# EAGLE design programmer8.0 (EAGLE 6.3)
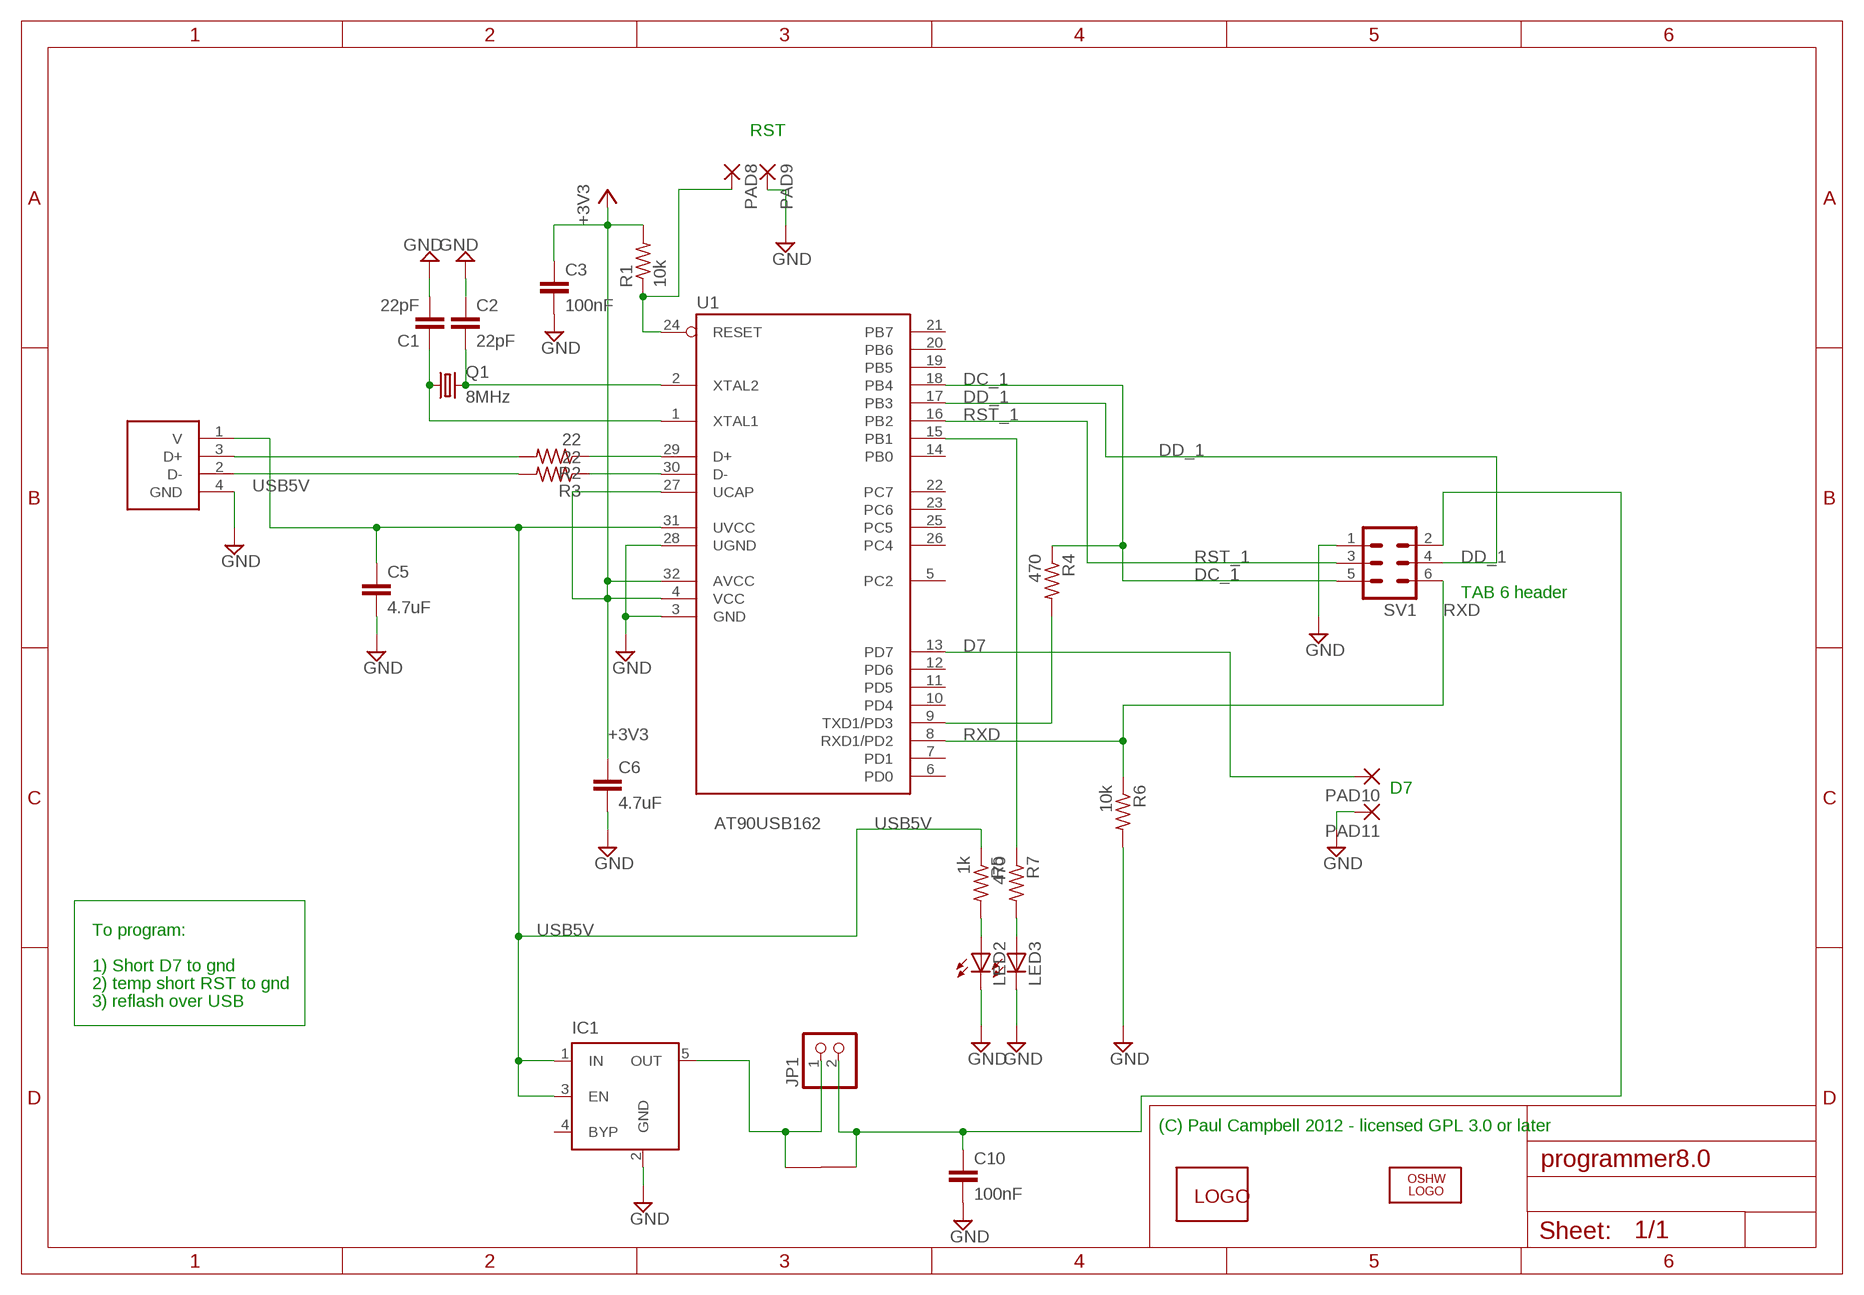
[diagram p0: schematic, sheet 1]

## Parts
C1  22pF  C-EUC0603  [C0603]
C2  22pF  C-EUC0603  [C0603]
C3  100nF  C-EUC0603  [C0603]
C5  4.7uF  C-EUC0805  [C0805]
C6  4.7uF  C-EUC0805  [C0805]
C10  100nF  C-EUC0603  [C0603]
IC1  MIC5219XX  [SOT23-5]
JP1  PINHD-1X2  [1X02]
LED2  LEDCHIP-LED0805  [CHIP-LED0805]
LED3  LEDCHIP-LED0805  [CHIP-LED0805]
LOGO2  OSHW_LOGO_FILLX0100-NT  [OSHW_FILLX100_NOTEXT]
PAD8  1,6/0,8  [1,6/0,8]
PAD9  1,6/0,8  [1,6/0,8]
PAD10  1,6/0,8  [1,6/0,8]
PAD11  1,6/0,8  [1,6/0,8]
Q1  8MHz  CRYSTALHC49UP  [HC49UP]
R1  10k  R-US_R0603  [R0603]
R2  22  R-US_R0603  [R0603]
R3  22  R-US_R0603  [R0603]
R4  470  R-US_R0603  [R0603]
R5  1k  R-US_R0603  [R0603]
R6  10k  R-US_R0603  [R0603]
R7  470  R-US_R0603  [R0603]
SV1  MA03-2  [MA03-2]
U1  AT90USB162  [TQFP32-08]
U$1  LINK  [LINK]
U$2  MOONBASE-LOGO  [MOONBASE-LOGO]
U$3  USB-RAW  [RAW-USB]

## Nets
+3V3: C3.1 C6.1 R1.2 U1.4(VCC) U1.27(UCAP) U1.32(AVCC)
D7: PAD10.1(P) U1.13(PD7)
DC_1: R4.1 SV1.5 U1.18(PB4)
DD_1: SV1.4 U1.17(PB3)
GND: C1.2 C2.1 C3.2 C5.2 C6.2 C10.2 IC1.2(GND) LED2.C LED3.C PAD9.1(P) PAD11.1(P) R6.2 SV1.1 U1.3(GND) U1.28(UGND) U$3.4(GND)
N$1: C1.1 Q1.1 U1.1(XTAL1)
N$2: C2.2 Q1.2 U1.2(XTAL2)
N$3: R2.1 U1.29(D+)
N$4: R3.1 U1.30(D-)
N$6: R4.2 U1.9(TXD1/PD3)
N$7: IC1.5(OUT) JP1.1 U$1.1
N$9: C10.1 JP1.2 SV1.2 U$1.2
N$10: R3.2 U$3.2(D-)
N$11: R2.2 U$3.3(D+)
N$18: LED2.A R5.2
N$22: LED3.A R7.2
N$23: R7.1 U1.15(PB1)
RST: PAD8.1(P) R1.1 U1.24(RESET)
RST_1: SV1.3 U1.16(PB2)
RXD: R6.1 SV1.6 U1.8(RXD1/PD2)
USB5V: C5.1 IC1.1(IN) IC1.3(EN) R5.1 U1.31(UVCC) U$3.1(V)
Unconnected: IC1.4(BYP) U1.5(PC2) U1.6(PD0) U1.7(PD1) U1.10(PD4) U1.11(PD5) U1.12(PD6) U1.14(PB0) U1.19(PB5) U1.20(PB6) U1.21(PB7) U1.22(PC7) U1.23(PC6) U1.25(PC5) U1.26(PC4)

## Notes on the sheet
- RST
- TAB 6 header
- D7
- To program:
- 1) Short D7 to gnd
- 2) temp short RST to gnd
- 3) reflash over USB
- (C) Paul Campbell 2012 - licensed GPL 3.0 or later

## Library data of the parts
C1-C3 C5 C6 C10 = rcl:C-EU: CAPACITOR, European symbol
IC1 = v-reg-micrel:MIC5219XX: VOLTAGE REGULATOR
JP1 = pinhead:PINHD-1X2: PIN HEADER
LED2 LED3 = led:LED: LED OSRAM: - CHIPLED LG R971, LG N971, LY N971, LG Q971, LY Q971, LO R971, LY R971 LH N974, LH R974 LS Q976, LO Q976, LY Q976 LO Q996 - Hyper CHIPLED LW Q18S LB Q993, LB Q99A, LB R99A - SideLED LS A670, LO A670, LY A670, LG A670, LP A670 LB A673, LV A673, LT A673, LW A673 LH A674 LY A675 LS A676, LA A676, LO A676, LY A676, LW A676 LS A679, LY A679, LG A679 - Hyper Micro SIDELED® LS Y876, LA Y876, LO Y876, LY Y876 LT Y87S - SmartLED LW L88C, LW L88S LB L89C, LB L89S, LG L890 LS L89K, LO L89K, LY L89K LS L896, LA L896, LO L896, LY L896 - TOPLED LS T670, LO T670, LY T670, LG T670, LP T670 LSG T670, LSP T670, LSY T670, LOP T670, LYG T670 LG T671, LOG T671, LSG T671 LB T673, LV T673, LT T673, LW T673 LH T674 LS T676, LA T676, LO T676, LY T676, LB T676, LH T676, LSB T676, LW T676 LB T67C, LV T67C, LT T67C, LS T67K, LO T67K, LY T67K, LW E67C LS E67B, LA E67B, LO E67B, LY E67B, LB E67C, LV E67C, LT E67C LW T67C LS T679, LY T679, LG T679 LS T770, LO T770, LY T770, LG T770, LP T770 LB T773, LV T773, LT T773, LW T773 LH T774 LS E675, LA E675, LY E675, LS T675 LS T776, LA T776, LO T776, LY T776, LB T776 LHGB T686 LT T68C, LB T68C - Hyper Mini TOPLED® LB M676 - Mini TOPLED Santana® LG M470 LS M47K, LO M47K, LY M47K Source: http://www.osram.convergy.de LUXEON: - LUMILED® LXK2-PW12-R00, LXK2-PW12-S00, LXK2-PW14-U00, LXK2-PW14-V00 LXK2-PM12-R00, LXK2-PM12-S00, LXK2-PM14-U00 LXK2-PE12-Q00, LXK2-PE12-R00, LXK2-PE12-S00, LXK2-PE14-T00, LXK2-PE14-U00 LXK2-PB12-K00, LXK2-PB12-L00, LXK2-PB12-M00, LXK2-PB14-N00, LXK2-PB14-P00, LXK2-PB14-Q00 LXK2-PR12-L00, LXK2-PR12-M00, LXK2-PR14-Q00, LXK2-PR14-R00 LXK2-PD12-Q00, LXK2-PD12-R00, LXK2-PD12-S00 LXK2-PH12-R00, LXK2-PH12-S00 LXK2-PL12-P00, LXK2-PL12-Q00, LXK2-PL12-R00 Source: www.luxeon.com KINGBRIGHT: KA-3528ASYC Source: www.kingbright.com
LOGO2 = ohw-logo:OSHW_LOGO_FILL
PAD8-PAD11 = wirepad:1,6/0,8: THROUGH-HOLE PAD
Q1 = crystal:CRYSTAL: CRYSTAL
R1-R7 = rcl:R-US_: RESISTOR, American symbol
SV1 = con-lstb:MA03-2: PIN HEADER
U1 = atmelnew:AT90USB162
U$1 = playa:LINK
U$2 = ll:MOONBASE-LOGO
U$3 = playa:USB-RAW

## Board
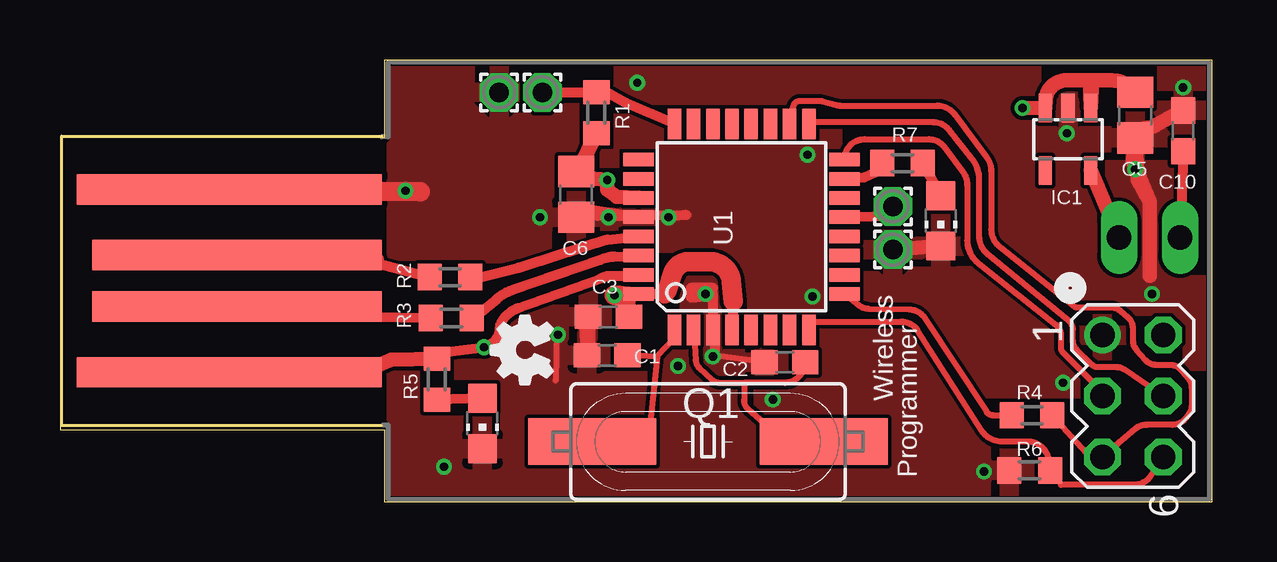
[diagram p1: board, top side]
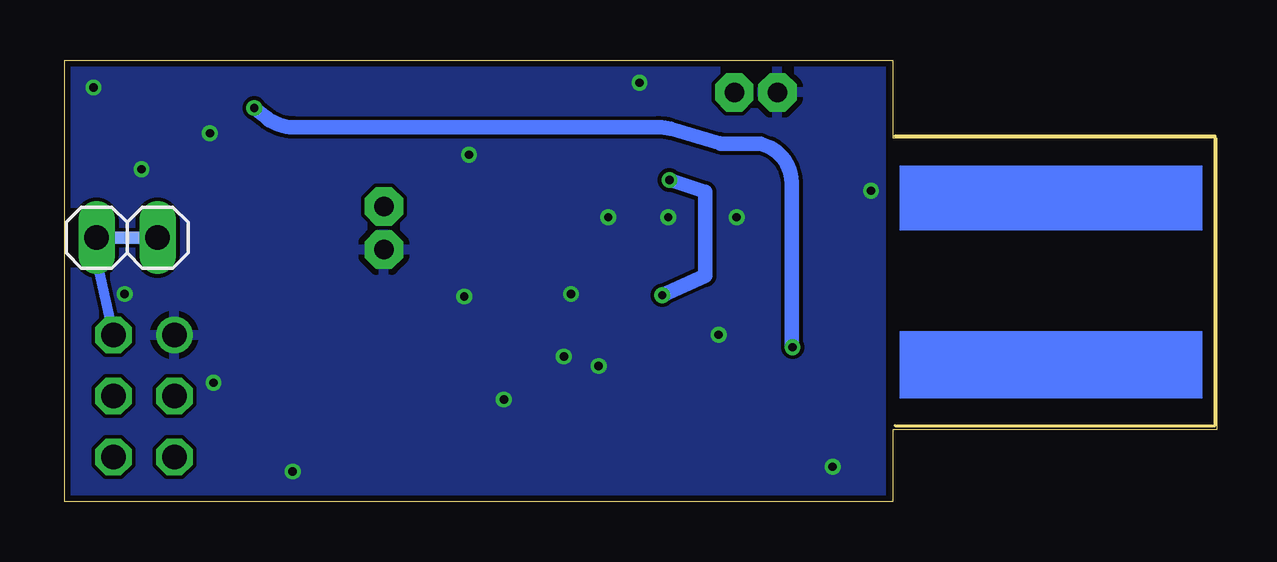
[diagram p2: board, bottom side, seen from below]

Size 48 x 18.4 mm. Coordinates in mm from the lower left corner, seen from the top.
Outline: 0,3 13.5,3 13.5,0 48,0 48,18.4 13.5,18.4 13.5,15.17 0,15.17 0,3
Copper layers (1*16): Top 0.035mm / dielectric 1.5mm / Bottom 0.035mm
Design rules "Fusion_eagle_rule_v1.1": minimum track width 6mil, minimum drill 12mil, track to track 6mil, track to pad 6mil, pad to pad 6mil, via to via 6mil, smd to smd 0mil, copper to edge 10mil, drill to drill 10mil, minimum pad ring 10mil, minimum via ring 6mil, stop-mask expansion 2mil, vias tented up to drill 100mil, thermal gap 10mil

### Footprints (pad centres in the part's own frame; a part is rotated, then mirrored left to right if it is on the bottom)
C0603 = smd 1.1 x 1: 1 -0.85,0; 2 0.85,0
C0805 = smd 1.3 x 1.5: 1 -0.95,0; 2 0.95,0
SOT23-5 = smd 0.55 x 1.2: 1 -0.95,-1.3; 2 0,-1.3; 3 0.95,-1.3; 4 0.95,1.3; 5 -0.95,1.3
1X02 = drill 1.016 long: 1 -1.27,0; 2 1.27,0
CHIP-LED0805 = smd 1.2 x 1.2: A 0,-1.05; C 0,1.05
1,6/0,8 = drill 0.813 pad 1.6 octagon: 1 0,0
HC49UP = smd 5.334 x 1.93: 1 -4.826,0; 2 4.826,0
R0603 = smd 1 x 1.1: 1 -0.85,0; 2 0.85,0
MA03-2 = drill 1.016: 1 -2.54,-1.27 | drill 1.016 octagon: 2 -2.54,1.27; 3 0,-1.27; 4 0,1.27; 5 2.54,-1.27; 6 2.54,1.27
TQFP32-08 = smd 1.27 x 0.559: 1 -4.293,2.8; 2 -4.293,2; 3 -4.293,1.2; 4 -4.293,0.4; 5 -4.293,-0.4; 6 -4.293,-1.2; 7 -4.293,-2; 8 -4.293,-2.8; 17 4.293,-2.8; 18 4.293,-2; 19 4.293,-1.2; 20 4.293,-0.4; 21 4.293,0.4; 22 4.293,1.2; 23 4.293,2; 24 4.293,2.8 | smd 0.559 x 1.27: 9 -2.8,-4.293; 10 -2,-4.293; 11 -1.2,-4.293; 12 -0.4,-4.293; 13 0.4,-4.293; 14 1.2,-4.293; 15 2,-4.293; 16 2.8,-4.293; 25 2.8,4.293; 26 2,4.293; 27 1.2,4.293; 28 0.4,4.293; 29 -0.4,4.293; 30 -1.2,4.293; 31 -2,4.293; 32 -2.8,4.293
LINK = smd 2 x 0.5: 1 -1,0; 2 1,0
RAW-USB = smd 1.27 x 12.7: 1 -3.81,6.35; 4 3.81,6.35 | smd 1.27 x 12.065: 2 -1.079,6.032; 3 1.079,6.032

### Placement (x,y rotation side)
C1  22.8,6.1 180 top
C2  30.2,5.8 0 top
C3  22.85,7.7 180 top
C5  44.8,16.1 270 top
C6  21.5,12.8 270 top
C10  46.8,15.45 90 top
IC1  42,15.1 180 top
JP1  45.4,11 180 bottom
LED2  17.6,3.25 180 top
LED3  36.7,11.7 180 top
LOGO2  20.5,4.9 90 top
PAD8  20.1,17.05 0 top
PAD9  18.3,17.05 0 top
PAD10  34.7,12.3 0 top
PAD11  34.7,10.5 0 top
Q1  27,2.5 0 top
R1  22.35,16.2 270 top
R2  16.25,9.35 180 top
R3  16.3,7.65 180 top
R4  40.5,3.6 180 top
R5  15.7,5.1 270 top
R6  40.4,1.3 180 top
R7  35.1,14.1 0 top
SV1  44.7,4.4 270 top
U1  28.4,11.45 90 top
U$1  45.4,11 180 bottom
U$2  41.4,5.6 90 top
U$3  13.4,9.2 90 top

### Tracks (layer width: path | path; a pad name or v marks a point on that pad's centre or on a via)
+3V3  (via drill 0.35)
  Top 0.406: 23.21,8.7 23.65,8.55 U1.32 25.2,8.65 | U1.4 28.05,8.35 27.9,8.6 | v22.8,13.4 21.85,13.4
  Top 0.61: U1.27 23.2,12.7 22.8,13 v22.8,13.4 | R1.2 21.8,14.2 21.3,13.6 21.6,13.5 v22.8,13.4 | v22.8,13.4 21.8,13.5 C6.1 | v23.1,8.6 23.65,8.55 23.7,7.9 C3.1
  Top 0.813: 25.2,8.65 25.3,8.8 25.54,9.51 arc-72 26.22,10 27.06,10 arc-85 27.98,9.16 28.05,8.35 | 23.65,8.55 23.29,8.61 v23.1,8.6
  Bottom 0.61: v22.8,13.4 21.3,12.9 21.3,9.4 v23.1,8.6
D7
  Top 0.406: U1.13 34.4,11.9 34.5,12.1 PAD10.1
DC_1
  Top 0.254: U1.18 30.55,16.46 arc-78 30.84,16.7 31.64,16.7 arc-16 31.75,16.68 32.31,16.53 arc16 32.5,16.5 36.54,16.5 arc-53 37.28,16.13 38.6,14.37 arc-37 38.8,13.77 38.8,11.33 arc51 39.14,10.63 42.3,8.1 43.77,8.1 arc-41 44.17,7.95 44.49,7.68 arc-49 44.7,7.22 44.7,6.72 arc41 44.85,6.33 45.22,5.91 arc49 45.67,5.7 46.28,5.7 arc-47 46.65,5.54 46.99,5.17 arc-43 47.15,4.76 47.15,3.97 arc-37 47.05,3.67 46.91,3.48 arc-53 46.35,3.2 45.3,3.2 arc40 44.78,3.01 SV1.5 43.06,1.89 arc-43 42.79,2.02 R4.1
DD_1
  Top 0.254: SV1.4 44.35,5.5 arc34 44.01,5.6 43.27,5.6 arc-45 42.98,5.72 42.35,6.35 arc-45 42.2,6.71 42.2,7.16 arc51 42.02,7.55 38.67,10.3 arc-51 38.3,11.07 38.3,13.45 arc38 38.02,14.25 37.06,15.47 arc52 36.39,15.8 31.4,15.8 31.3,16 31.2,15.9
  Top 0.406: 31.2,15.9 U1.17
GND  (via drill 0.35)
  Top 0.254: 20.7,7.1 20.65,5.05 | C2.1 27.2,6.1 v27.2,6.05
  Top 0.406: v27.2,6.05 27.3,6.3 27.2,8.5 27.2,8.9 26.3,8.9 26.3,8.5 27.2,8.6 U1.3 | v25.35,11.85 26.1,11.95 22.4,11.9 U1.28 22.2,12.15
  Top 0.61: LED3.C PAD11.1 | C10.2 45.67,15.69 arc-19 45.31,15.57 44.9,15.5 44.7,14.2 45.4,12.5 | 45.4,9.4 45.4,12.5 | 45.4,12.5 44.9,13.4 C5.2 | C3.2 22,6 21.9,7.7
  Top 0.813: U$3.4 15,12.9
  other vias: 38.5,1.25 44.8,13.85 20,11.85 16,1.45 31.35,8.55 31.15,14.45 20.75,6.95 14.4,12.95 25.75,5.65 41.95,15.35 24.05,17.45 41.8,4.95 46.8,17.25 45.5,8.65 29.7,4.25 22.85,11.85 26.9,8.65
  pour Bottom: 14,18.4 14,0 48,0 48,18.4
  pour Top: 14,18.4 14,0 48,0 48,18.4
N$1
  Top 0.254: U1.1 25.6,6.8 24.89,6.06 | 24.89,6.06 24.6,3.3 Q1.1 | C1.1 24.1,6.1 24.89,6.06
N$2
  Top 0.254: U1.2 26.49,5.9 arc43 26.64,5.57 27.16,5.09 arc43 27.5,4.95 28.5,4.95 | 28.5,4.95 28.5,4.23 arc49 28.67,3.85 29.3,3.3 Q1.2 | C2.2 30.97,5.53 arc-74 30.2,4.95 28.5,4.95
N$3
  Top 0.406: U1.29 22.81,10.91 arc12 22.59,10.87 19.1,9.75 17.5,9.35 17.25,9.2 R2.1
N$4
  Top 0.406: U1.30 23.1,10.21 arc22 22.53,10.07 18.86,8.82 arc21 18.21,8.46 17.3,7.7 17.05,7.65 R3.1
N$6
  Top 0.254: U1.9 33.28,8.19 arc37 33.67,8.04 35.38,8.01 arc-55 36.03,7.65 38.61,3.74 arc57 38.87,3.6 R4.2
N$7
  Top 0.61: IC1.5 JP1.1
  Bottom 0.406: JP1.1 U$1.1
N$9
  Top 0.406: C10.1 JP1.2
  Bottom 0.406: SV1.2 46.67,10 U$1.2 JP1.2
N$10
  Top 0.406: 12.7,7.9 12.8,7.7 R3.2
  Top 0.813: U$3.2 12.7,7.9
N$11
  Top 0.406: 13.1,10.05 13.3,9.9 R2.2
  Top 0.813: U$3.3 13.1,10.05
N$18
  Top 0.406: LED2.A R5.2
N$22
  Top 0.406: R7.2 LED3.A
N$23
  Top 0.406: R7.1 34.2,13.8 33.5,13.5 U1.15
RST
  Top 0.406: U1.24 23.6,16.6 22.7,17.1 R1.1 PAD8.1
RST_1
  Top 0.254: U1.16 32.71,14.39 arc-83 33.51,15.1 36.21,15.1 arc-53 36.83,14.79 37.62,13.74 arc-37 37.8,13.2 37.8,10.88 arc52 38.25,9.94 41.51,7.35 arc-52 41.7,6.96 41.7,6.43 arc45 41.79,6.21 43.2,4.8 43.7,4.4 SV1.3
RXD
  Top 0.254: U1.8 31.2,7.5 35.06,7.5 arc-57 35.74,7.13 38.41,2.96 arc57 39.25,2.5 40.31,2.5 arc-66 41.14,1.96 41.4,1.39 | SV1.6 45.44,1.06 arc-56 44.77,0.7 41.7,0.7 41.4,1.39 | R6.1 41.4,1.39
USB5V  (via drill 0.35)
  Top 0.254: R5.1 15.8,6.2
  Top 0.406: U1.31 23.5,9.4 22.92,9.4 arc30 22.51,9.29 19.11,8.08 arc20 18.73,7.86 18.64,7.79 arc47 18.32,7.18 arc-52 17.99,6.59 17.86,6.5 arc-25 v17.67,6.43 15.8,6.2 | 11.6,5.3 12.44,5.28
  Top 0.61: 42.9,17.55 41.94,17.55 arc88 41.06,16.71 IC1.3 v40.1,16.4 | 43,17.55 IC1.1 42.9,17.55 | 42.9,17.55 43,17.55 | 43,17.55 43.83,17.55 arc-51 44.75,17.11 C5.1 | 12.44,5.28 13.3,5.7 13.8,5.9 R5.1 | U$3.1 11.6,5.3
  Bottom 0.406: v17.67,6.43 17.7,6.5
  Bottom 0.61: 17.7,6.5 17.7,13.15 arc-63 18.59,14.75 19,14.9 20.48,14.9 arc16 20.71,14.93 22.75,15.53 arc-16 23.26,15.6 38.48,15.6 arc39 39.59,15.99 v40.1,16.4
(copper drawn outside any net)
  shapes: Bottom area x2

### Text on the board
tNames: Wireless | Programmer
tDocu: RST | (C) Paul / Campbell / 2013 | D7 | V8.0